# EAGLE design メイン回路１ (EAGLE 9.6.2)
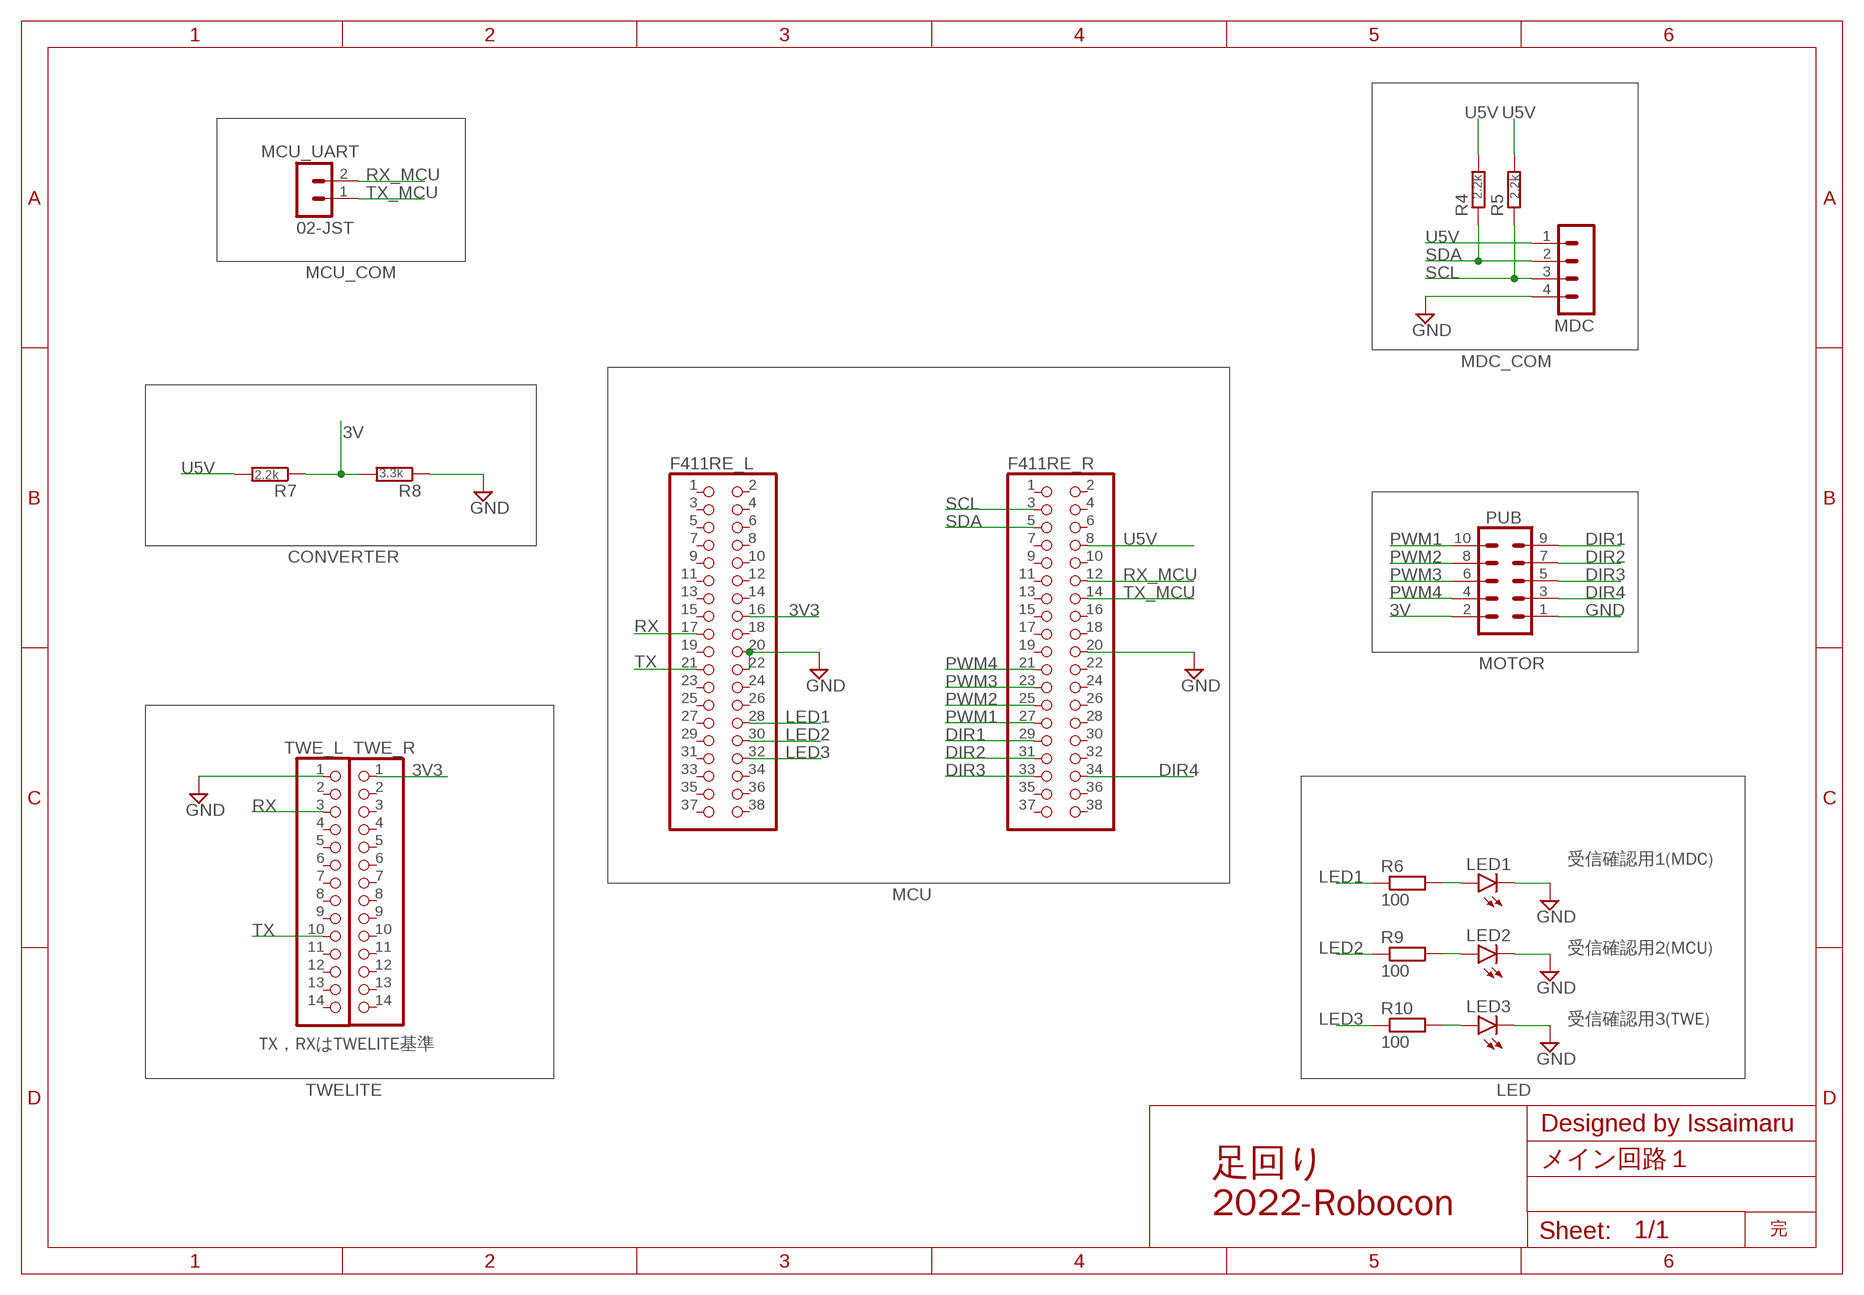
[diagram p0: schematic, sheet 1]

## Parts
F411RE_L  PINHD-2X19  [2X19]
F411RE_R  PINHD-2X19  [2X19]
LED1  LED5MM  [LED5MM]
LED2  LED5MM  [LED5MM]
LED3  LED5MM  [LED5MM]
MCU_UART  02-JST  [B2B-XH]
MDC  04-JST  [B4B-XH]
PUB  ML10  [ML10]
R4  2.2k  R-EU_0204/7  [0204/7]
R5  2.2k  R-EU_0204/7  [0204/7]
R6  100  R-EU_0204/7  [0204/7]
R7  2.2k  R-EU_0204/7  [0204/7]
R8  3.3k  R-EU_0204/7  [0204/7]
R9  100  R-EU_0204/7  [0204/7]
R10  100  R-EU_0204/7  [0204/7]
TWE_L  PINHD-1X14  [1X14]
TWE_R  PINHD-1X14  [1X14]

## Nets
3V: PUB.2 R7.1 R8.2
3V3: F411RE_L.16 TWE_R.1
DIR1: F411RE_R.29 PUB.9
DIR2: F411RE_R.31 PUB.7
DIR3: F411RE_R.33 PUB.5
DIR4: F411RE_R.34 PUB.3
GND: F411RE_L.20 F411RE_L.22 F411RE_R.20 LED1.K(C) LED2.K(C) LED3.K(C) MDC.4 PUB.1 R8.1 TWE_L.1
LED1: F411RE_L.28 R6.1
LED2: F411RE_L.30 R9.1
LED3: F411RE_L.32 R10.1
N$1: LED2.A R9.2
N$2: LED1.A R6.2
N$3: LED3.A R10.2
PWM1: F411RE_R.27 PUB.10
PWM2: F411RE_R.25 PUB.8
PWM3: F411RE_R.23 PUB.6
PWM4: F411RE_R.21 PUB.4
RX: F411RE_L.17 TWE_L.3
RX_MCU: F411RE_R.12 MCU_UART.2
SCL: F411RE_R.3 MDC.3 R5.1
SDA: F411RE_R.5 MDC.2 R4.1
TX: F411RE_L.21 TWE_L.10
TX_MCU: F411RE_R.14 MCU_UART.1
U5V: F411RE_R.8 MDC.1 R4.2 R5.2 R7.2
Unconnected: F411RE_L.1 F411RE_L.2 F411RE_L.3 F411RE_L.4 F411RE_L.5 F411RE_L.6 F411RE_L.7 F411RE_L.8 F411RE_L.9 F411RE_L.10 F411RE_L.11 F411RE_L.12 F411RE_L.13 F411RE_L.14 F411RE_L.15 F411RE_L.18 F411RE_L.19 F411RE_L.23 F411RE_L.24 F411RE_L.25 F411RE_L.26 F411RE_L.27 F411RE_L.29 F411RE_L.31 F411RE_L.33 F411RE_L.34 F411RE_L.35 F411RE_L.36 F411RE_L.37 F411RE_L.38 F411RE_R.1 F411RE_R.2 F411RE_R.4 F411RE_R.6 F411RE_R.7 F411RE_R.9 F411RE_R.10 F411RE_R.11 F411RE_R.13 F411RE_R.15 F411RE_R.16 F411RE_R.17 F411RE_R.18 F411RE_R.19 F411RE_R.22 F411RE_R.24 F411RE_R.26 F411RE_R.28 F411RE_R.30 F411RE_R.32 F411RE_R.35 F411RE_R.36 F411RE_R.37 F411RE_R.38 TWE_L.2 TWE_L.4 TWE_L.5 TWE_L.6 TWE_L.7 TWE_L.8 TWE_L.9 TWE_L.11 TWE_L.12 TWE_L.13 TWE_L.14 TWE_R.2 TWE_R.3 TWE_R.4 TWE_R.5 TWE_R.6 TWE_R.7 TWE_R.8 TWE_R.9 TWE_R.10 TWE_R.11 TWE_R.12 TWE_R.13 TWE_R.14

## Notes on the sheet
- MCU_COM
- MDC_COM
- CONVERTER
- MOTOR
- 受信確認用1(MDC)
- MCU
- 受信確認用2(MCU)
- 受信確認用3(TWE)
- TX，RXはTWELITE基準
- TWELITE | LED
- Designed by Issaimaru
- 足回り
  2022-Robocon
- 完

## Library data of the parts
F411RE_L F411RE_R = pinhead:PINHD-2X19: PIN HEADER
LED1-LED3 = led:LED: LED OSRAM: - CHIPLED LG R971, LG N971, LY N971, LG Q971, LY Q971, LO R971, LY R971 LH N974, LH R974 LS Q976, LO Q976, LY Q976 LO Q996 - Hyper CHIPLED LW Q18S LB Q993, LB Q99A, LB R99A - SideLED LS A670, LO A670, LY A670, LG A670, LP A670 LB A673, LV A673, LT A673, LW A673 LH A674 LY A675 LS A676, LA A676, LO A676, LY A676, LW A676 LS A679, LY A679, LG A679 - Hyper Micro SIDELED® LS Y876, LA Y876, LO Y876, LY Y876 LT Y87S - SmartLED LW L88C, LW L88S LB L89C, LB L89S, LG L890 LS L89K, LO L89K, LY L89K LS L896, LA L896, LO L896, LY L896 - TOPLED LS T670, LO T670, LY T670, LG T670, LP T670 LSG T670, LSP T670, LSY T670, LOP T670, LYG T670 LG T671, LOG T671, LSG T671 LB T673, LV T673, LT T673, LW T673 LH T674 LS T676, LA T676, LO T676, LY T676, LB T676, LH T676, LSB T676, LW T676 LB T67C, LV T67C, LT T67C, LS T67K, LO T67K, LY T67K, LW E67C LS E67B, LA E67B, LO E67B, LY E67B, LB E67C, LV E67C, LT E67C LW T67C LS T679, LY T679, LG T679 LS T770, LO T770, LY T770, LG T770, LP T770 LB T773, LV T773, LT T773, LW T773 LH T774 LS E675, LA E675, LY E675, LS T675 LS T776, LA T776, LO T776, LY T776, LB T776 LHGB T686 LT T68C, LB T68C - Hyper Mini TOPLED® LB M676 - Mini TOPLED Santana® LG M470 LS M47K, LO M47K, LY M47K Source: http://www.osram.convergy.de LUXEON: - LUMILED® LXK2-PW12-R00, LXK2-PW12-S00, LXK2-PW14-U00, LXK2-PW14-V00 LXK2-PM12-R00, LXK2-PM12-S00, LXK2-PM14-U00 LXK2-PE12-Q00, LXK2-PE12-R00, LXK2-PE12-S00, LXK2-PE14-T00, LXK2-PE14-U00 LXK2-PB12-K00, LXK2-PB12-L00, LXK2-PB12-M00, LXK2-PB14-N00, LXK2-PB14-P00, LXK2-PB14-Q00 LXK2-PR12-L00, LXK2-PR12-M00, LXK2-PR14-Q00, LXK2-PR14-R00 LXK2-PD12-Q00, LXK2-PD12-R00, LXK2-PD12-S00 LXK2-PH12-R00, LXK2-PH12-S00 LXK2-PL12-P00, LXK2-PL12-Q00, LXK2-PL12-R00 Source: www.luxeon.com KINGBRIGHT: KA-3528ASYC Source: www.kingbright.com
MCU_UART = con-jst-xh (1):02-JST: JST CONNECTOR
MDC = con-jst-xh:04-JST: JST CONNECTOR
PUB = con-ml:ML10: HARTING; OC_FARNELL: unknown; OC_NEWARK: unknown
R4-R10 = rcl:R-EU_: RESISTOR, European symbol; SPICEPREFIX: R
TWE_L TWE_R = pinhead:PINHD-1X14: PIN HEADER

## Board
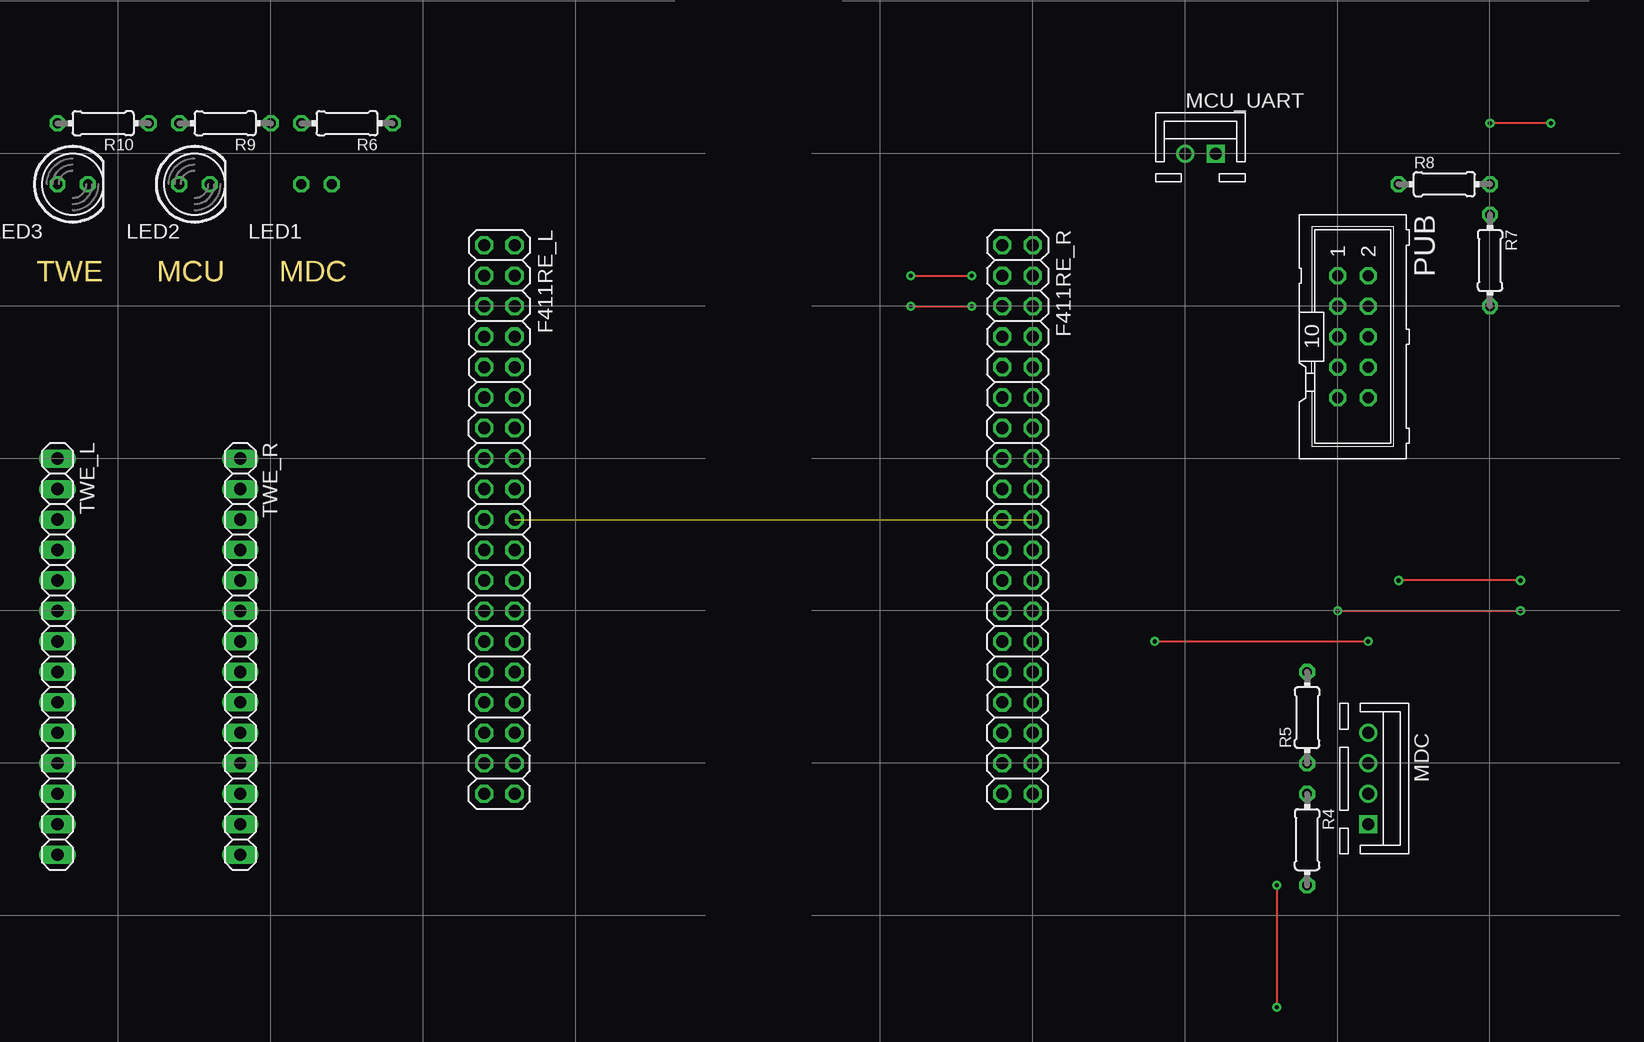
[diagram p1: board, top side]
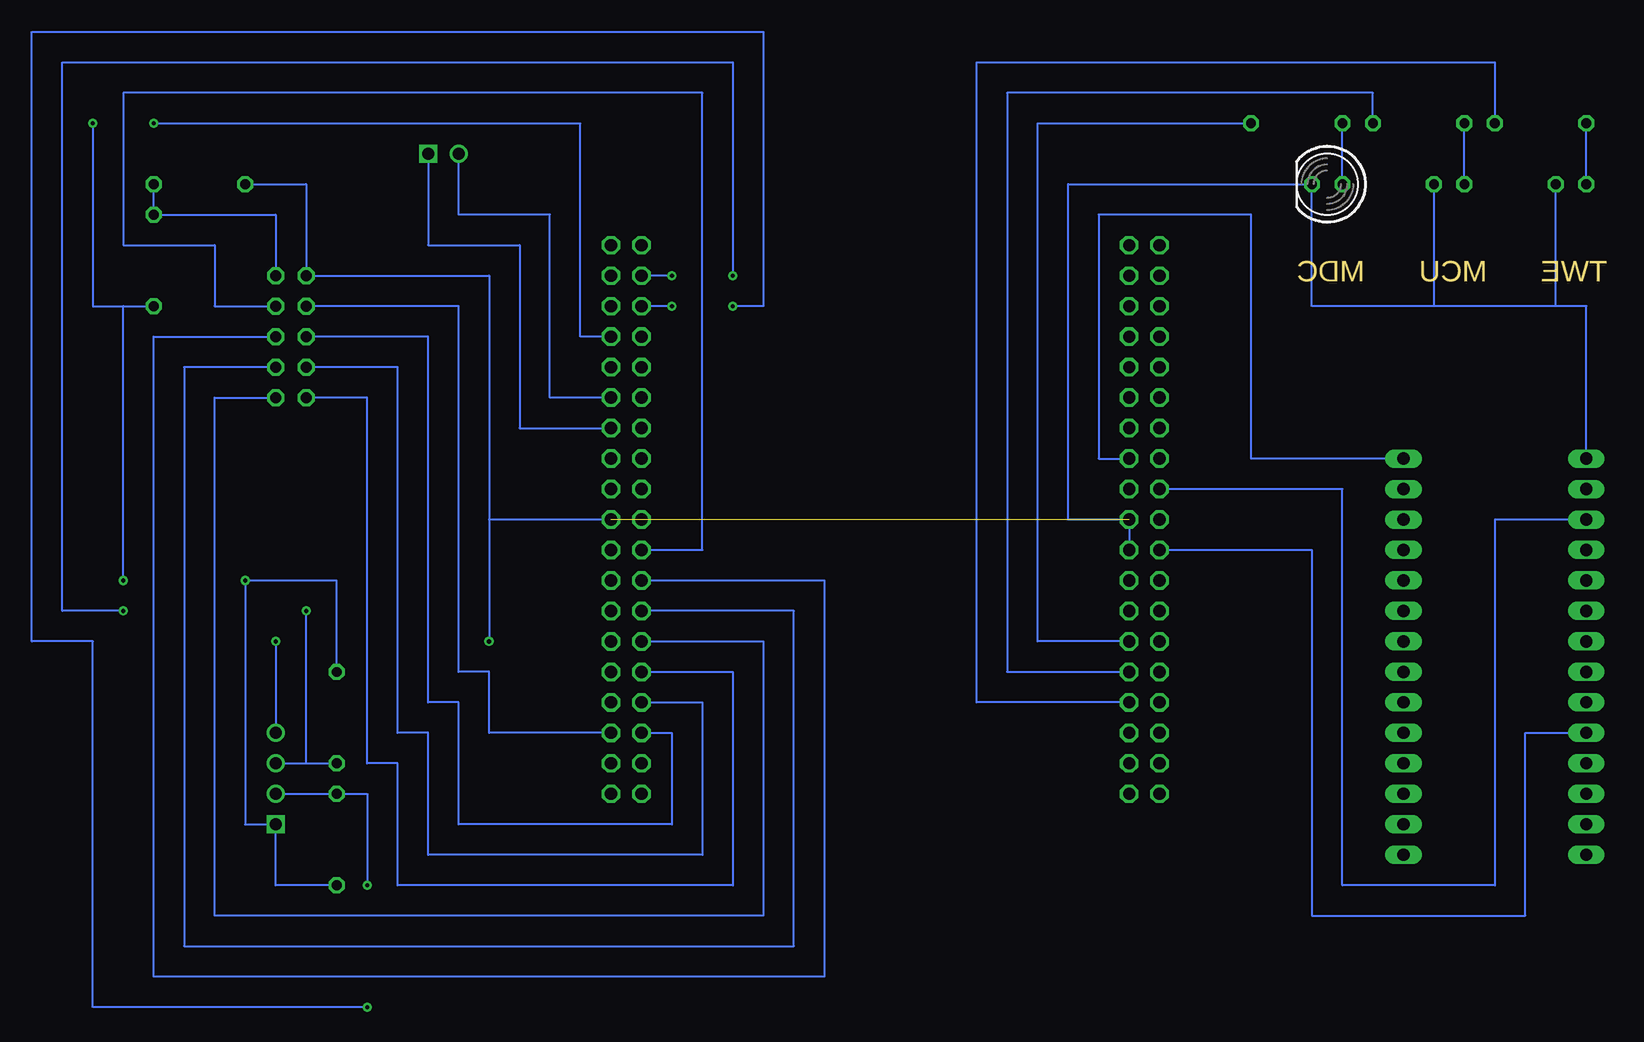
[diagram p2: board, bottom side, seen from below]

No outline drawn. Coordinates in mm, seen from the top.
Copper layers (1*16): Top 0.035mm / dielectric 1.5mm / Bottom 0.035mm
Design rules "default": minimum track width 6mil, minimum drill 0.35mm, track to track 6mil, track to pad 6mil, pad to pad 6mil, via to via 6mil, smd to smd 6mil, copper to edge 40mil, drill to drill 6mil, minimum pad ring 10mil, minimum via ring 8mil, stop-mask expansion 4mil, vias tented up to drill 0mil, thermal gap 10mil

### Footprints (pad centres in the part's own frame; a part is rotated, then mirrored left to right if it is on the bottom)
2X19 = drill 1.016 octagon: 1 -22.86,-1.27; 2 -22.86,1.27; 3 -20.32,-1.27; 4 -20.32,1.27; 5 -17.78,-1.27; 6 -17.78,1.27; 7 -15.24,-1.27; 8 -15.24,1.27; 9 -12.7,-1.27; 10 -12.7,1.27; 11 -10.16,-1.27; 12 -10.16,1.27; 13 -7.62,-1.27; 14 -7.62,1.27; 15 -5.08,-1.27; 16 -5.08,1.27; 17 -2.54,-1.27; 18 -2.54,1.27; 19 0,-1.27; 20 0,1.27; 21 2.54,-1.27; 22 2.54,1.27; 23 5.08,-1.27; 24 5.08,1.27; 25 7.62,-1.27; 26 7.62,1.27; 27 10.16,-1.27; 28 10.16,1.27; 29 12.7,-1.27; 30 12.7,1.27; 31 15.24,-1.27; 32 15.24,1.27; 33 17.78,-1.27; 34 17.78,1.27; 35 20.32,-1.27; 36 20.32,1.27; 37 22.86,-1.27; 38 22.86,1.27
LED5MM = drill 0.813 octagon: A -1.27,0; K 1.27,0
B2B-XH = drill 1 square: 1 1.27,0 | drill 1: 2 -1.27,0
B4B-XH = drill 1 square: 1 3.81,0 | drill 1: 2 1.27,0; 3 -1.27,0; 4 -3.81,0
ML10 = drill 0.914 octagon: 1 -5.08,-1.27; 2 -5.08,1.27; 3 -2.54,-1.27; 4 -2.54,1.27; 5 0,-1.27; 6 0,1.27; 7 2.54,-1.27; 8 2.54,1.27; 9 5.08,-1.27; 10 5.08,1.27
0204/7 = drill 0.813 octagon: 1 -3.81,0; 2 3.81,0
1X14 = drill 1.016 long: 1 -16.51,0; 2 -13.97,0; 3 -11.43,0; 4 -8.89,0; 5 -6.35,0; 6 -3.81,0; 7 -1.27,0; 8 1.27,0; 9 3.81,0; 10 6.35,0; 11 8.89,0; 12 11.43,0; 13 13.97,0; 14 16.51,0

### Placement (x,y rotation side)
F411RE_L  36.83,30.48 270 top
F411RE_R  80.01,30.48 270 top
LED1  21.59,58.42 180 bottom
LED2  11.43,58.42 0 top
LED3  1.27,58.42 0 top
MCU_UART  95.25,60.96 0 top
MDC  109.22,8.89 270 top
PUB  107.95,45.72 270 top
R4  104.14,3.81 270 top
R5  104.14,13.97 90 top
R6  24.13,63.5 180 top
R7  119.38,52.07 270 top
R8  115.57,58.42 0 top
R9  13.97,63.5 180 top
R10  3.81,63.5 180 top
TWE_L  0,19.05 270 top
TWE_R  15.24,19.05 270 top
U$1  [TYPE.B]  55.88,-15.24 90 top
U$2  [TYPE.B]  132.08,-15.24 90 top

### Tracks (layer width: path | path; a pad name or v marks a point on that pad's centre or on a via)
3V
  Bottom 0.152: R8.2 R7.1 109.22,55.88 PUB.2
3V3
  Bottom 0.152: TWE_R.1 27.94,35.56 27.94,55.88 40.64,55.88 40.64,35.56 F411RE_L.16
DIR1
  Bottom 0.152: F411RE_R.29 71.12,17.78 71.12,0 99.06,0 99.06,10.16 101.6,10.16 101.6,40.64 PUB.9
DIR2
  Bottom 0.152: F411RE_R.31 73.66,15.24 73.66,2.54 96.52,2.54 96.52,12.7 99.06,12.7 99.06,43.18 PUB.7
DIR3
  Bottom 0.152: F411RE_R.33 76.2,12.7 76.2,5.08 93.98,5.08 93.98,15.24 96.52,15.24 96.52,45.72 PUB.5
DIR4
  Bottom 0.152: PUB.3 93.98,48.26 93.98,17.78 91.44,17.78 91.44,12.7 F411RE_R.34
GND  (via drill 0.35)  (1 unrouted)
  Top 0.152: v91.44,20.32 v109.22,20.32
  Bottom 0.152: F411RE_L.22 F411RE_L.20 43.18,30.48 43.18,58.42 LED1.K 22.86,48.26 12.7,48.26 | TWE_L.1 0,48.26 2.54,48.26 | 2.54,48.26 LED3.K | 2.54,48.26 12.7,48.26 | LED2.K 12.7,48.26 | R8.1 106.68,58.42 PUB.1 91.44,50.8 91.44,30.48 | F411RE_R.20 91.44,30.48 | 91.44,30.48 v91.44,20.32 | v109.22,20.32 MDC.4
LED1
  Bottom 0.152: F411RE_L.28 45.72,20.32 45.72,63.5 R6.1
LED2
  Bottom 0.152: R9.1 17.78,66.04 48.26,66.04 48.26,17.78 F411RE_L.30
LED3
  Bottom 0.152: F411RE_L.32 50.8,15.24 50.8,68.58 7.62,68.58 R10.1
N$1
  Bottom 0.152: LED2.A R9.2
N$2
  Bottom 0.152: LED1.A R6.2
N$3
  Bottom 0.152: LED3.A R10.2
PWM1
  Bottom 0.152: F411RE_R.27 68.58,20.32 68.58,-2.54 114.3,-2.54 114.3,40.64 PUB.10
PWM2
  Bottom 0.152: PUB.8 116.84,43.18 116.84,-5.08 66.04,-5.08 66.04,22.86 F411RE_R.25
PWM3
  Bottom 0.152: F411RE_R.23 63.5,25.4 63.5,-7.62 119.38,-7.62 119.38,45.72 PUB.6
PWM4
  Bottom 0.152: PUB.4 114.3,48.26 114.3,53.34 121.92,53.34 121.92,66.04 73.66,66.04 73.66,27.94 F411RE_R.21
RX
  Bottom 0.152: TWE_L.3 7.62,30.48 7.62,0 20.32,0 20.32,33.02 F411RE_L.17
RX_MCU
  Bottom 0.152: F411RE_R.12 86.36,40.64 86.36,55.88 93.98,55.88 MCU_UART.2
SCL  (via drill 0.35)
  Top 0.152: v106.68,22.86 v121.92,22.86 | v71.12,50.8 v76.2,50.8
  Bottom 0.152: MDC.3 106.68,10.16 | 106.68,10.16 R5.1 | 106.68,10.16 v106.68,22.86 | v121.92,22.86 127,22.86 127,68.58 71.12,68.58 v71.12,50.8 | v76.2,50.8 F411RE_R.3
SDA  (via drill 0.35)
  Top 0.152: v101.6,0 v101.6,-10.16 | v71.12,48.26 v76.2,48.26
  Bottom 0.152: MDC.2 R4.1 101.6,7.62 v101.6,0 | v101.6,-10.16 124.46,-10.16 124.46,20.32 129.54,20.32 129.54,71.12 68.58,71.12 68.58,48.26 v71.12,48.26 | v76.2,48.26 F411RE_R.5
TX
  Bottom 0.152: F411RE_L.21 22.86,27.94 22.86,-2.54 5.08,-2.54 5.08,12.7 TWE_L.10
TX_MCU
  Bottom 0.152: MCU_UART.1 96.52,53.34 88.9,53.34 88.9,38.1 F411RE_R.14
U5V  (via drill 0.35)
  Top 0.152: v124.46,63.5 v119.38,63.5 | v121.92,25.4 v111.76,25.4
  Bottom 0.152: R4.2 109.22,0 MDC.1 111.76,5.08 v111.76,25.4 104.14,25.4 R5.2 | F411RE_R.8 83.82,45.72 83.82,63.5 v119.38,63.5 | v124.46,63.5 124.46,48.26 121.92,48.26 | 121.92,48.26 R7.2 | v121.92,25.4 121.92,48.26

### Text on the board
Milling: TWE | MCU | MDC